# Altium schematic sheet Smart Energy Monitoring System.SchDoc
size A4; SheetNumber: 1; SheetTotal: 6
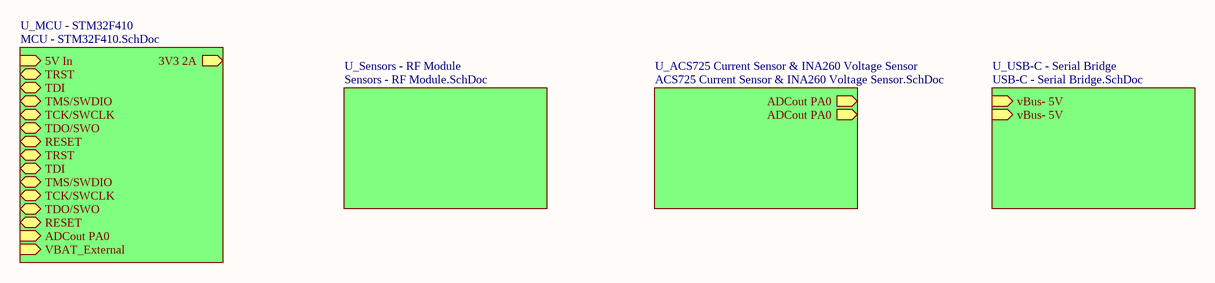
[diagram p0: Smart Energy Monitoring System.SchDoc]

## Sub-sheets
U_ACS725 Current Sensor & INA260 Voltage Sensor = ACS725 Current Sensor & INA260 Voltage Sensor.SchDoc: ADCout PA0 (out), ADCout PA0 (out)
U_MCU - STM32F410 = MCU - STM32F410.SchDoc: 5V In (in), 3V3 2A (out), TRST (bidir), TDI (bidir), TMS/SWDIO (bidir), TCK/SWCLK (bidir), TDO/SWO (bidir), RESET (bidir), TRST (bidir), TDI (bidir), TMS/SWDIO (bidir), TCK/SWCLK (bidir), TDO/SWO (bidir), RESET (bidir), ADCout PA0 (in), VBAT_External (in)
U_Sensors - RF Module = Sensors - RF Module.SchDoc: no entries
U_USB-C - Serial Bridge = USB-C - Serial Bridge.SchDoc: vBus- 5V (in), vBus- 5V (in)